# Altium schematic sheet HA_Out.SchDoc: transc
size A4; Date: 11/21/2016 9:12:50 PM; Author: TO; Revision: VA; SheetNumber: 1; PageSetup: Record=PageOptions|CenterHorizontal=True|CenterVertical=True|PrintScale=0.85|XCorrection=1.00|YCorrection=1.00|PrintKind=0|BorderSize=5000000|LeftOffset=0|BottomOffset=0|Orientation=2|PaperLength=1000|PaperWidth=1000|Scale=100|PaperSource=7|PrintQuality=-4|MediaType=1|DitherType=10|PrintScaleMode=1|PaperKind=A4 (Borderless)|PaperIndex=274
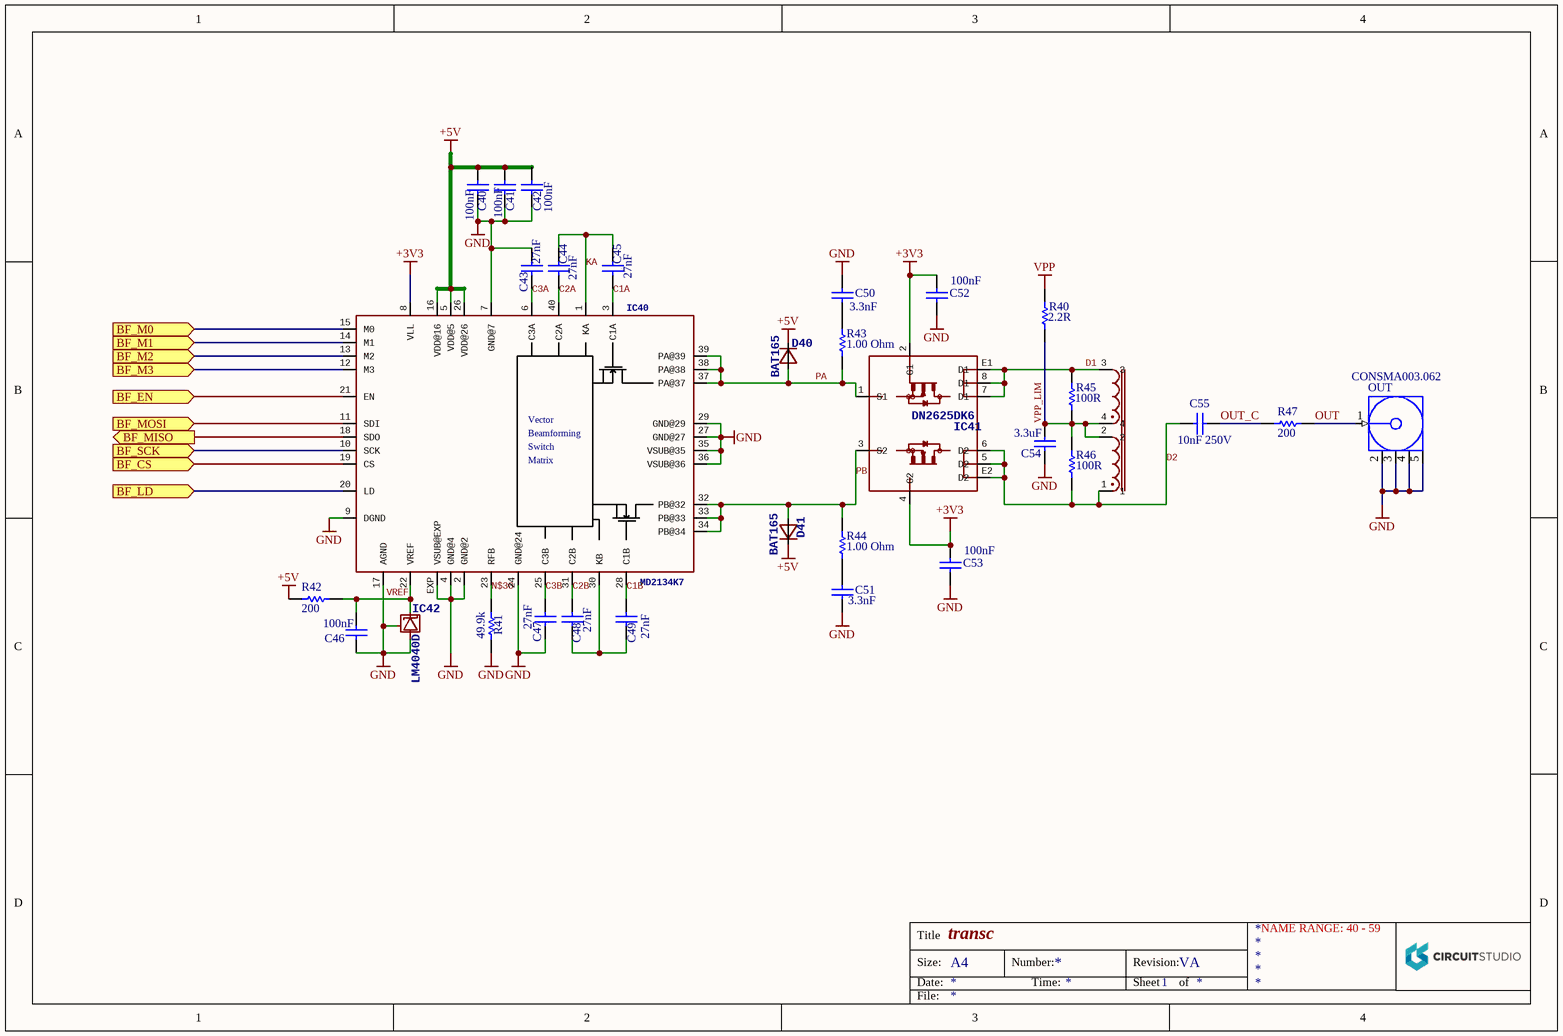
[diagram p0: HA_Out.SchDoc]

## Parts
C40  value 100nF  [CAPC0603(1608)100_L]  (hidden comment: 100nF 100V)
C41  value 100nF  [CAPC0603(1608)100_L]  (hidden comment: 100nF 100V)
C42  value 100nF  [CAPC0603(1608)100_L]  (hidden comment: 100nF 100V)
C43  value 27nF  [CAPC0603(1608)100_L]  (hidden comment: 27nF 100V)
C44  value 27nF  [CAPC0603(1608)100_L]  (hidden comment: 27nF 100V)
C45  value 27nF  [CAPC0603(1608)100_L]  (hidden comment: 27nF 100V)
C46  value 100nF  [CAPC0603(1608)100_L]  (hidden comment: 100nF 100V)
C47  value 27nF  [CAPC0603(1608)100_L]  (hidden comment: 27nF 100V)
C48  value 27nF  [CAPC0603(1608)100_L]  (hidden comment: 27nF 100V)
C49  value 27nF  [CAPC0603(1608)100_L]  (hidden comment: 27nF 100V)
C50  value 3.3nF  [CAPC0805(2012)75_N]  (hidden comment: 3.3nF 100V)
C51  value 3.3nF  [CAPC0805(2012)75_N]  (hidden comment: 3.3nF 100V)
C52  value 100nF  [CAPC0603(1608)100_L]  (hidden comment: 100nF 100V)
C53  value 100nF  [CAPC0603(1608)100_L]  (hidden comment: 100nF 100V)
C54  value 3.3uF  [CAPC1206(3216)190_N]  (hidden comment: 3.3uF 100V)
C55  10nF 250V  [CAPC0805(2012)75_N]
D40  BAT165  [SOD323]
D41  BAT165  [SOD323]
IC40  MD2134K7  [QFN40-5X5]
IC41  DN2625DK6  [DFN8K6]
IC42  LM4040D  [DBZ_R-PDSO-G3]
L40  LPD6235-682MEB  [LPD5235MR]  (value not drawn)
OUT  CONSMA003.062  [CON-SMA-EDGE062]
R40  value 2.2R  [RESC2512(6432)_M]  (hidden comment: 2.2R 5%)
R41  49.9k  [RESC0603(1608)_N]
R42  200  [RESC0603(1608)_N]
R43  value 1.00 Ohm  [RESC2512(6432)_M]  (hidden comment: 1R 5%)
R44  value 1.00 Ohm  [RESC2512(6432)_M]  (hidden comment: 1R 5%)
R45  value 100R  [RESC2512(6432)_M]  (hidden comment: 100R 5%)
R46  value 100R  [RESC2512(6432)_M]  (hidden comment: 100R 5%)
R47  value 200  [RESC0805(2012)_L]  (hidden comment: 200R 1% 0805(2012))

## Ports
BF_CS (in), BF_EN (in), BF_LD (in), BF_M0 (in), BF_M1 (in), BF_M2 (in), BF_M3 (in), BF_MISO (out), BF_MOSI (in), BF_SCK (in)

## Nets
+3V3: C52.2 C53.2 IC40.8(VLL) IC41.2(G1) IC41.4(G2)
+5V: C40.2 C41.2 C42.2 D40.C D41.C IC40.5(VDD@5) IC40.16(VDD@16) IC40.26(VDD@26) R42.2
GND: C40.1 C41.1 C42.1 C43.2 C46.1 C47.1 C50.2 C51.1 C52.1 C53.1 C54.1 IC40.2(GND@2) IC40.4(GND@4) IC40.7(GND@7) IC40.9(DGND) IC40.17(AGND) IC40.24(GND@24) IC40.27(GND@27) IC40.29(GND@29) IC40.35(VSUB@35) IC40.36(VSUB@36) IC40.EXP(VSUB@EXP) IC42.2(A) IC42.3(FB) OUT.2(GND) OUT.3(GND) OUT.4(GND) OUT.5(GND) R41.1
VPP: R40.2
BF_CS: IC40.19(CS) ; port BF_CS
BF_EN: IC40.21(EN) ; port BF_EN
BF_LD: IC40.20(LD) ; port BF_LD
BF_M0: IC40.15(M0) ; port BF_M0
BF_M1: IC40.14(M1) ; port BF_M1
BF_M2: IC40.13(M2) ; port BF_M2
BF_M3: IC40.12(M3) ; port BF_M3
BF_MISO: IC40.18(SDO) ; port BF_MISO
BF_MOSI: IC40.11(SDI) ; port BF_MOSI
BF_SCK: IC40.10(SCK) ; port BF_SCK
C1A: C45.1 IC40.3(C1A)
C1B: C49.2 IC40.28(C1B)
C2A: C44.1 IC40.40(C2A)
C2B: C48.2 IC40.31(C2B)
C3A: C43.1 IC40.6(C3A)
C3B: C47.2 IC40.25(C3B)
D1: IC41.7(D1) IC41.8(D1) IC41.E1(D1) L40.3 R45.2
D2: C55.2 IC41.5(D2) IC41.6(D2) IC41.E2(D2) L40.1 R46.1
KA: C44.2 C45.2 IC40.1(KA)
N$30: IC40.23(RFB) R41.2
OUT: OUT.1(Signal) R47.2
OUT_C: C55.1 R47.1
PA: D40.A IC40.37(PA@37) IC40.38(PA@38) IC40.39(PA@39) IC41.1(S1) R43.1
PB: D41.A IC40.32(PB@32) IC40.33(PB@33) IC40.34(PB@34) IC41.3(S2) R44.2
VPP_LIM: C54.2 L40.2 L40.4 R40.1 R45.1 R46.2
VREF: C46.2 IC40.22(VREF) IC42.1(C) R42.1
NetC48_1: C48.1 C49.1 IC40.30(KB)
NetC50_1: C50.1 R43.2
NetC51_2: C51.2 R44.1

## Notes on the sheet
- NAME RANGE: 40 - 59
- Title
- Size:
- Date:
- A4
- Number:
- Time:
- Revision:
- Sheet
- of
- File:
- (in symbol MD2134K7) Vector; Beamforming; Switch; Matrix

## Library data of the parts
C40-C42 C46 C52 C53 = CMP-1035-00529-1: CAP 100nF 100V ±10% 0603 (1608 Metric) Thickness 1mm SMD; Case-Metric: 1608; Case-EIA: 0603; Rated Voltage: 100 V; Max Thickness: 1 mm; Technology: SMT; Tolerance: ±10%
C43-C45 C47-C49 = CMP-1035-00529-1: CAP 27nF 100V ±10% 0603 (1608 Metric) Thickness 1mm SMD; Case-Metric: 1608; Case-EIA: 0603; Rated Voltage: 100 V; Max Thickness: 1 mm; Technology: SMT; Tolerance: ±10%
C50 C51 = CMP-1036-00417-1: CAP 3.3nF 100V 0805 (2012 Metric) Thickness 0.75mm SMD; Case-EIA: 0805; Tolerance: ±10%; Case-Metric: 2012; Technology: SMT; Max Thickness: 0.75 mm; Rated Voltage: 100 V
C54 = CMP-1037-04411-1: CAP 3.3uF 100V ±20% 1206 (3216 Metric) Thickness 1.9mm SMD; Case-Metric: 3216; Tolerance: Â±20%; Case-EIA: 1206; Max Thickness: 1.9 mm; Rated Voltage: 100 V; Technology: SMT
C55 = CMP-1036-00417-1: CAP 0805 (2012 Metric) Thickness 0.75mm SMD; Case-EIA: 0805; Tolerance: ±10%; Case-Metric: 2012; Technology: SMT; Max Thickness: 0.75 mm; Value: 10nF; Rated Voltage: 250 V
D40 D41 = DIODE_SOD323
IC42 = LM4040DBZ: PRECISION MICROPOWER SHUNT VOLTAGE REFERENCE Adjustable Output   Source: http://focus.ti.com/lit/ds/slcs146e/slcs146e.pdf
L40 = LPD5235MR: Coilcraft
OUT = CONSMA003.062: SMA Female Edge Mount Connector; PCB_Layout: Pads complies with manufacturer's recommendation.; DatasheetVersion: rev1.0, Aug-2006; PackageVersion: rev1.0, Aug-2006; PackageReference: CON-SMA-EDGE062; PackageDescription: SMA Female Edge Mount Connector for 0.062" Thick Board, 7.9 mm Body Dia.; ComponentLink1Description: Manufacturer URL; ComponentLink1URL: http://www.linxtechnologies.com/; ComponentLink2Description: Datasheet; ComponentLink2URL: http://www.connectorcity.com/diagrams/SMA/CONSMA003.062.pdf
R40 = CMP-1018-00050-1: 1W 5% 2512 (6432 Metric)  SMD; Case-EIA: 2512; Case-Metric: 6432; Tolerance: 5 %; Power: 1 W; Technology: SMT
R41 = CMP-1012-00122-1: 49.9k 1% 0603 SMD; Value: 49.9k Ohm; Tolerance: 1 %
R42 = CMP-1012-00122-1: 200 1% 0603 SMD; Value: 200 Ohm; Tolerance: 1 %
R43 R44 = CMP-1018-00050-1: 1R 1W 5% 2512 (6432 Metric)  SMD; Case-EIA: 2512; Case-Metric: 6432; Tolerance: 5 %; Power: 1 W; Technology: SMT
R45 R46 = CMP-1018-00050-1: 100R 1W 5% 2512 (6432 Metric)  SMD; Case-EIA: 2512; Case-Metric: 6432; Tolerance: 5 %; Power: 1 W; Technology: SMT
R47 = CMP-1013-00429-1: 0.125W 1% 0805 (2012 Metric)  SMD; Case-EIA: 0805; Case-Metric: 2012; Technology: SMT; Power: 0.125 W; Tolerance: 1 %
IC40 = MD2134K7: MPN: MD2134K7